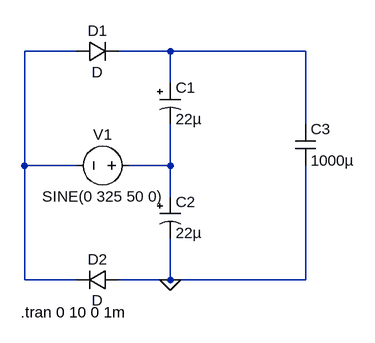
[diagram p0: schematic fullwave-doubler.asc]
fullwave-doubler.asc, the LTspice schematic file:
Version 4
SHEET 1 880 680
WIRE 96 -16 16 -16
WIRE 240 -16 160 -16
WIRE 448 -16 240 -16
WIRE 240 32 240 -16
WIRE 448 96 448 -16
WIRE 16 160 16 -16
WIRE 96 160 16 160
WIRE 240 160 240 96
WIRE 240 160 176 160
WIRE 240 208 240 160
WIRE 16 336 16 160
WIRE 96 336 16 336
WIRE 240 336 240 272
WIRE 240 336 160 336
WIRE 448 336 448 160
WIRE 448 336 240 336
FLAG 240 336 0
SYMBOL voltage 192 160 R90
WINDOW 0 -32 56 VBottom 2
WINDOW 3 32 56 VTop 2
WINDOW 123 0 0 Left 2
WINDOW 39 0 0 Left 2
SYMATTR InstName V1
SYMATTR Value SINE(0 325 50 0)
SYMBOL diode 96 0 R270
WINDOW 0 32 32 VTop 2
WINDOW 3 0 32 VBottom 2
SYMATTR InstName D1
SYMBOL diode 160 320 R90
WINDOW 0 0 32 VBottom 2
WINDOW 3 32 32 VTop 2
SYMATTR InstName D2
SYMBOL polcap 224 32 R0
WINDOW 3 24 56 Left 2
SYMATTR InstName C1
SYMATTR Value 22µ
SYMATTR Description Capacitor
SYMATTR Type cap
SYMATTR SpiceLine V=450 Rser=2.4 Lser=0
SYMBOL polcap 224 208 R0
WINDOW 3 24 56 Left 2
SYMATTR InstName C2
SYMATTR Value 22µ
SYMATTR Description Capacitor
SYMATTR Type cap
SYMATTR SpiceLine V=450 Irms=0 Rser=2.4 Lser=0
SYMBOL cap 432 96 R0
SYMATTR InstName C3
SYMATTR Value 1000µ
SYMATTR SpiceLine V=450 Rser=100m
TEXT 10 386 Left 2 !.tran 0 10 0 1m

The netlist it stands for:
* fullwave-doubler.asc
V1 N003 N001 SINE(0 325 50 0)
D1 N001 N002 D
D2 0 N001 D
C1 N002 N003 22µ V=450 Rser=2.4 Lser=0
C2 N003 0 22µ V=450 Irms=0 Rser=2.4 Lser=0
C3 N002 0 1000µ V=450 Rser=100m
.model D D
.lib standard.dio
.tran 0 10 0 1m
.backanno
.end